# EAGLE design houz_bedroom (EAGLE 9.2.2)
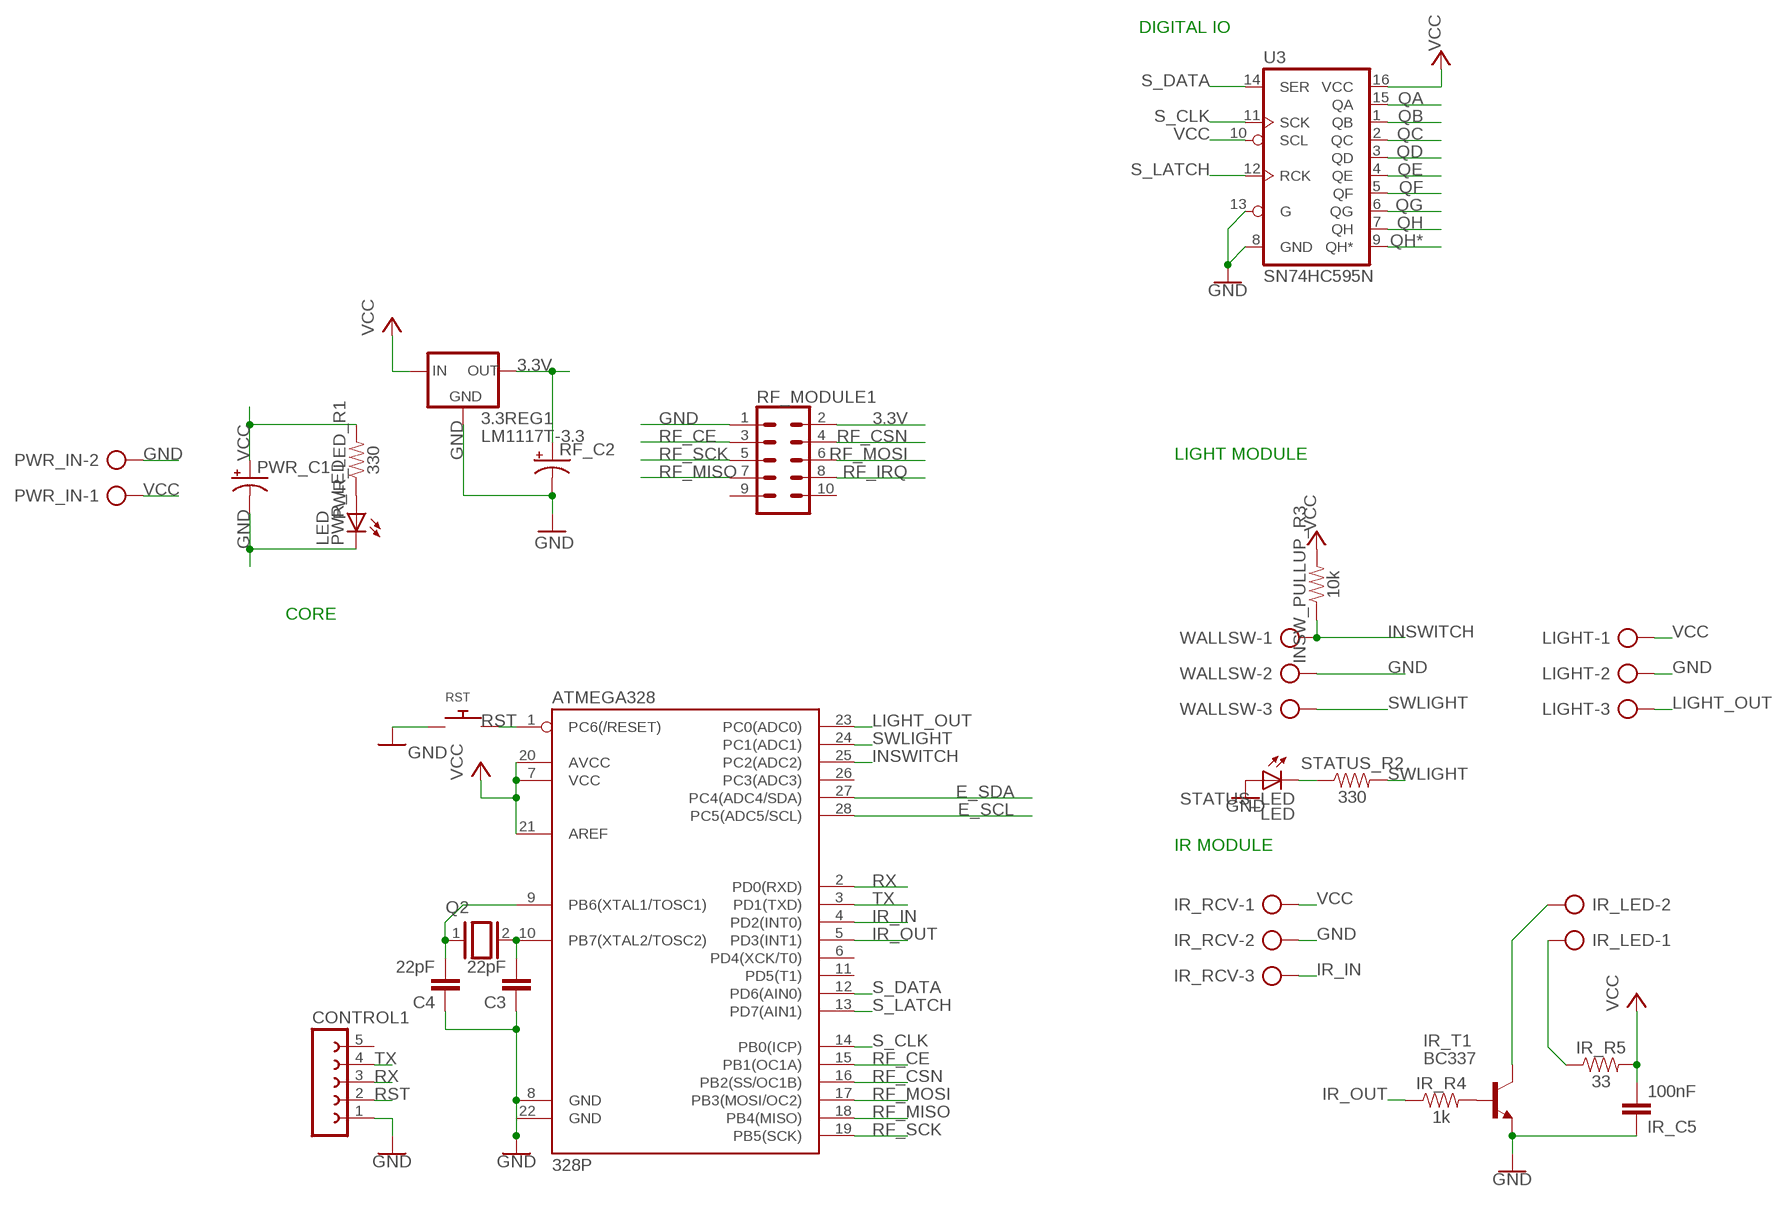
[diagram p0: schematic, sheet 1]

## Parts
3.3REG1  LM1117T-3.3  [TO220]
ATMEGA328  328P  ATMEGA328P_PDIP  [DIP28]
C3  22pF  C-EU050-030X075  [C050-030X075]
C4  22pF  C-EU050-030X075  [C050-030X075]
CONTROL1  FE05-1  [FE05-1]
INSW_PULLUP_R3  10k  RESISTORAXIAL-0.3  [AXIAL-0.3]
IR_C5  100nF  C-EU050-030X075  [C050-030X075]
IR_LED  AK500/2-H  [AK500/2-H]
IR_R4  1k  RESISTORAXIAL-0.3  [AXIAL-0.3]
IR_R5  33  RESISTORAXIAL-0.3  [AXIAL-0.3]
IR_RCV  AK500/3  [AK500/3]
IR_T1  BC337  [TO92]
LIGHT  AK500/3  [AK500/3]
PWR_C1  CPOL-USE7.5-16  [E7,5-16]
PWR_IN  AK500/2-H  [AK500/2-H]
PWR_LED  LED  LED3MM  [LED3MM]
PWR_LED_R1  330  RESISTORAXIAL-0.3  [AXIAL-0.3]
Q2  16MHz  XTAL/S  [QS]
RF_C2  CPOL-USE5-10.5  [E5-10,5]
RF_MODULE1  CONN_05X2NO_SILK  [2X5_NOSILK]
RST  SWITCH_PUSHBUTTONEVQ-PE  [TACT_PANA-EVQ]
STATUS_LED  LED  LED3MM  [LED3MM]
STATUS_R2  330  RESISTORAXIAL-0.3  [AXIAL-0.3]
U3  SN74HC595N  74HC595N  [DIP16]
WALLSW  AK500/3  [AK500/3]

## Nets
3.3V: 3.3REG1.2(OUT) RF_C2.+ RF_MODULE1.2
E_SCL: ATMEGA328.28(PC5(ADC5/SCL))
E_SDA: ATMEGA328.27(PC4(ADC4/SDA))
GND: 3.3REG1.1(GND) ATMEGA328.8(GND) ATMEGA328.22(GND) C3.1 C4.1 CONTROL1.1 IR_C5.1 IR_RCV.2 IR_T1.1(E) LIGHT.2 PWR_C1.- PWR_IN.2 PWR_LED.K(C) RF_C2.- RF_MODULE1.1 RST.P$1 STATUS_LED.A U3.8(GND) U3.13(G) WALLSW.2
INSWITCH: ATMEGA328.25(PC2(ADC2)) INSW_PULLUP_R3.P$1 WALLSW.1
IR_IN: ATMEGA328.4(PD2(INT0)) IR_RCV.3
IR_LED1: IR_LED.1 IR_R5.P$1
IR_LED2: IR_LED.2 IR_T1.3(C)
IR_OUT: ATMEGA328.5(PD3(INT1)) IR_R4.P$1
IR_T1_B: IR_R4.P$2 IR_T1.2(B)
LIGHT_OUT: ATMEGA328.23(PC0(ADC0)) LIGHT.3
N$1: PWR_LED.A PWR_LED_R1.P$1
QA: U3.15(QA)
QB: U3.1(QB)
QC: U3.2(QC)
QD: U3.3(QD)
QE: U3.4(QE)
QF: U3.5(QF)
QG: U3.6(QG)
QH: U3.7(QH)
QH*: U3.9(QH*)
RF_CE: ATMEGA328.15(PB1(OC1A)) RF_MODULE1.3
RF_CSN: ATMEGA328.16(PB2(SS/OC1B)) RF_MODULE1.4
RF_IRQ: RF_MODULE1.8
RF_MISO: ATMEGA328.18(PB4(MISO)) RF_MODULE1.7
RF_MOSI: ATMEGA328.17(PB3(MOSI/OC2)) RF_MODULE1.6
RF_SCK: ATMEGA328.19(PB5(SCK)) RF_MODULE1.5
RST: ATMEGA328.1(PC6(/RESET)) CONTROL1.2 RST.P$2
RX: ATMEGA328.2(PD0(RXD)) CONTROL1.3
S_CLK: ATMEGA328.14(PB0(ICP)) U3.11(SCK)
S_DATA: ATMEGA328.12(PD6(AIN0)) U3.14(SER)
S_LATCH: ATMEGA328.13(PD7(AIN1)) U3.12(RCK)
ST_R2: STATUS_LED.K(C) STATUS_R2.P$1
SWLIGHT: ATMEGA328.24(PC1(ADC1)) STATUS_R2.P$2 WALLSW.3
TX: ATMEGA328.3(PD1(TXD)) CONTROL1.4
VCC: 3.3REG1.3(IN) ATMEGA328.7(VCC) ATMEGA328.20(AVCC) ATMEGA328.21(AREF) INSW_PULLUP_R3.P$2 IR_C5.2 IR_R5.P$2 IR_RCV.1 LIGHT.1 PWR_C1.+ PWR_IN.1 PWR_LED_R1.P$2 U3.10(SCL) U3.16(VCC)
X3: ATMEGA328.9(PB6(XTAL1/TOSC1)) C4.2 Q2.1
X4: ATMEGA328.10(PB7(XTAL2/TOSC2)) C3.2 Q2.2
Unconnected: ATMEGA328.6(PD4(XCK/T0)) ATMEGA328.11(PD5(T1)) ATMEGA328.26(PC3(ADC3)) CONTROL1.5 RF_MODULE1.9 RF_MODULE1.10

## Notes on the sheet
- DIGITAL IO
- LIGHT MODULE
- CORE
- IR MODULE

## Library data of the parts
3.3REG1 = lm1117:LM1117T-*
ATMEGA328 = SparkFun-IC-Microcontroller:ATMEGA328P_PDIP: Atmel 328P Through hole ATMEGA328P uC used in the Arduino 32kb flash, 1k EEPROM, 2k SRAM Datasheet <http://www.sparkfun.com/datasheets/Components/SMD/ATMega328.pdf> SparkFun Products Storefront component: AVR 28 Pin 20MHz 32K 6A/D - ATMega328P <https://www.sparkfun.com/products/9061> (COM-09061) SparkFun Simon Says - Through-Hole Soldering Kit <https://www.sparkfun.com/products/10547> (KIT-10547) SparkFun Learn to Solder - Simon Says <https://www.sparkfun.com/products/13708> (KIT-13708) SparkFun BigTime Watch Kit <https://www.sparkfun.com/products/11734> (KIT-11734) SparkFun ClockIt <https://www.sparkfun.com/products/10930> (KIT-10930) SparkFun Serial Enabled LCD Kit <https://www.sparkfun.com/products/10097> (LCD-10097) SparkFun Simon Tilts - Through Hole Soldering Kit <https://www.sparkfun.com/products/12634> (KIT-12634) SparkFun Frequency Counter Kit <https://www.sparkfun.com/products/10140> (KIT-10140) FabFM Radio Kit <https://www.sparkfun.com/products/11043> (KIT-11043) SparkFun Binary Blaster Kit <https://www.sparkfun.com/products/12037> (KIT-12037) SparkFun Metro-Gnome <https://www.sparkfun.com/products/9236> (KIT-09236) ATmega328 with Arduino Optiboot (Uno) <https://www.sparkfun.com/products/10524> (DEV-10524); PROD_ID: IC-09136
C3 C4 IR_C5 = rcl:C-EU: CAPACITOR, European symbol; SPICEPREFIX: C
CONTROL1 = con-lsta:FE05-1: FEMALE HEADER; OC_FARNELL: unknown; OC_NEWARK: unknown
INSW_PULLUP_R3 IR_R4 IR_R5 PWR_LED_R1 STATUS_R2 = SparkFun-Resistors:RESISTOR: Generic Resistor Package
IR_LED PWR_IN = con-ptr500:AK500/2-H: CONNECTOR Aug. 2004 / PTR Meßtechnik: Die Bezeichnung der Serie AK505 wurde geändert. Es handelt sich hierbei um AK500 in horizontaler Ausführung.; OC_FARNELL: unknown; OC_NEWARK: unknown
IR_RCV LIGHT WALLSW = con-ptr500:AK500/3: CONNECTOR; OC_FARNELL: unknown; OC_NEWARK: unknown
IR_T1 = transistor:BC337: NPN TRANSISTOR
PWR_C1 RF_C2 = adafruit:CPOL-US: POLARIZED CAPACITOR, American symbol
PWR_LED STATUS_LED = adafruit:LED: LED OSRAM: - CHIPLED LG R971, LG N971, LY N971, LG Q971, LY Q971, LO R971, LY R971 LH N974, LH R974 LS Q976, LO Q976, LY Q976 LO Q996 - Hyper CHIPLED LW Q18S LB Q993, LB Q99A, LB R99A - SideLED LS A670, LO A670, LY A670, LG A670, LP A670 LB A673, LV A673, LT A673, LW A673 LH A674 LY A675 LS A676, LA A676, LO A676, LY A676, LW A676 LS A679, LY A679, LG A679 - Hyper Micro SIDELED® LS Y876, LA Y876, LO Y876, LY Y876 LT Y87S - SmartLED LW L88C, LW L88S LB L89C, LB L89S, LG L890 LS L89K, LO L89K, LY L89K LS L896, LA L896, LO L896, LY L896 - TOPLED LS T670, LO T670, LY T670, LG T670, LP T670 LSG T670, LSP T670, LSY T670, LOP T670, LYG T670 LG T671, LOG T671, LSG T671 LB T673, LV T673, LT T673, LW T673 LH T674 LS T676, LA T676, LO T676, LY T676, LB T676, LH T676, LSB T676, LW T676 LB T67C, LV T67C, LT T67C, LS T67K, LO T67K, LY T67K, LW E67C LS E67B, LA E67B, LO E67B, LY E67B, LB E67C, LV E67C, LT E67C LW T67C LS T679, LY T679, LG T679 LS T770, LO T770, LY T770, LG T770, LP T770 LB T773, LV T773, LT T773, LW T773 LH T774 LS E675, LA E675, LY E675, LS T675 LS T776, LA T776, LO T776, LY T776, LB T776 LHGB T686 LT T68C, LB T68C - Hyper Mini TOPLED® LB M676 - Mini TOPLED Santana® LG M470 LS M47K, LO M47K, LY M47K Source: http://www.osram.convergy.de/
Q2 = special:XTAL/S: CRYSTAL
RF_MODULE1 = SparkFun-Connectors:CONN_05X2: Multi connection point. Often used as Generic Header-pin footprint for 0.1 inch spaced/style header connections For AVR SPI programming port, see special device with nice symbol: "AVR_SPI_PROG_5x2.dev" You can populate with any combo of single row headers, but if you'd like an exact match, check these: 2x5 AVR ICSP Male Header <https://www.sparkfun.com/products/778> (PRT-00778) 2x5 Pin Shrouded Header <https://www.sparkfun.com/products/8506> (PRT-08506) On any of the 0.1 inch spaced packages, you can populate with these: Break Away Headers - Straight <https://www.sparkfun.com/products/116> (PRT-00116) Break Away Male Headers - Right Angle <https://www.sparkfun.com/products/553> (PRT-00553) Female Headers <https://www.sparkfun.com/products/115> (PRT-00115) Break Away Headers - Machine Pin <https://www.sparkfun.com/products/117> (PRT-00117) Break Away Female Headers - Swiss Machine Pin <https://www.sparkfun.com/products/743> (PRT-00743) Special note: the shrouded connector mates well with our 5x2 ribbon cables: 2x5 Pin IDC Ribbon Cable <https://www.sparkfun.com/products/8535> (PRT-08535)
RST = adafruit:SWITCH_PUSHBUTTON: Buttons SOFTTOUCHSMD_SJ - Soft touch temporary push button (Super Junk Akihabara) Compatible with SKPMANE010 [Mouser: 688-SKPMAN] C&K_KSS = Digikey: KSS221GLFS
U3 = SparkFun-IC-Logic:74*595: 8-Bit Shift Register (Serial to Parallel) Datasheet <http://cdn.sparkfun.com/datasheets/BreakoutBoards/MM74HC595.pdf> SparkFun Products SparkFun Shift Register Breakout - 74HC595 <https://www.sparkfun.com/products/10680> (BOB-10680); PROD_ID: IC-13123

## Net classes
0 default: clearance 0.205 mm

## Board
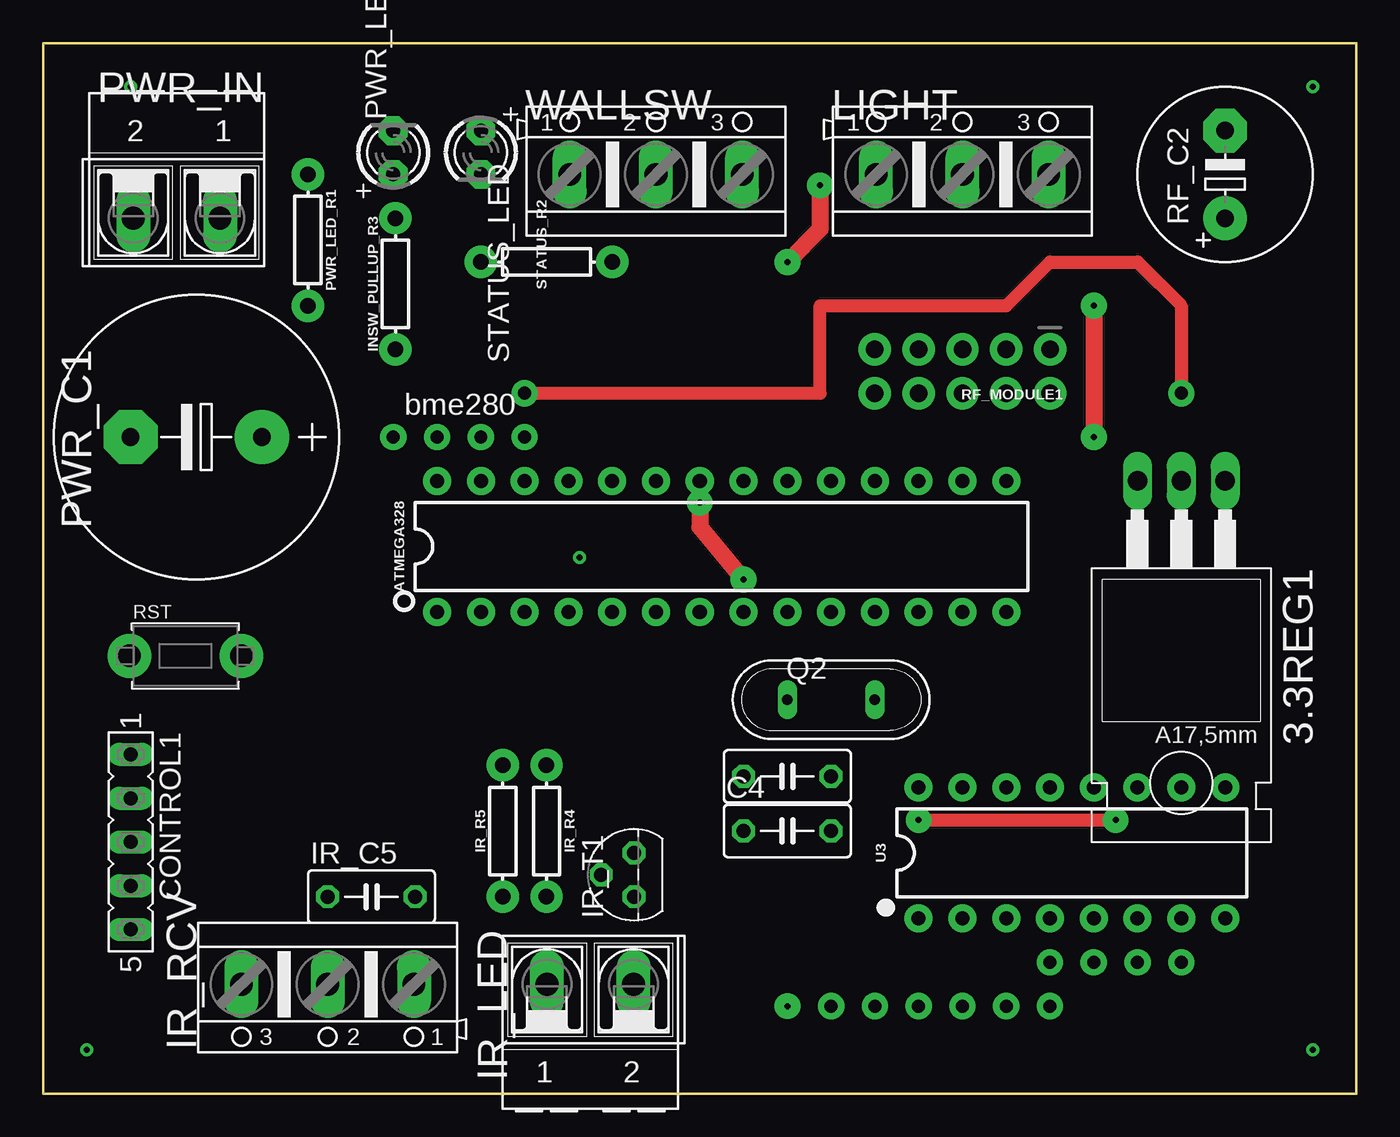
[diagram p1: board, top side]
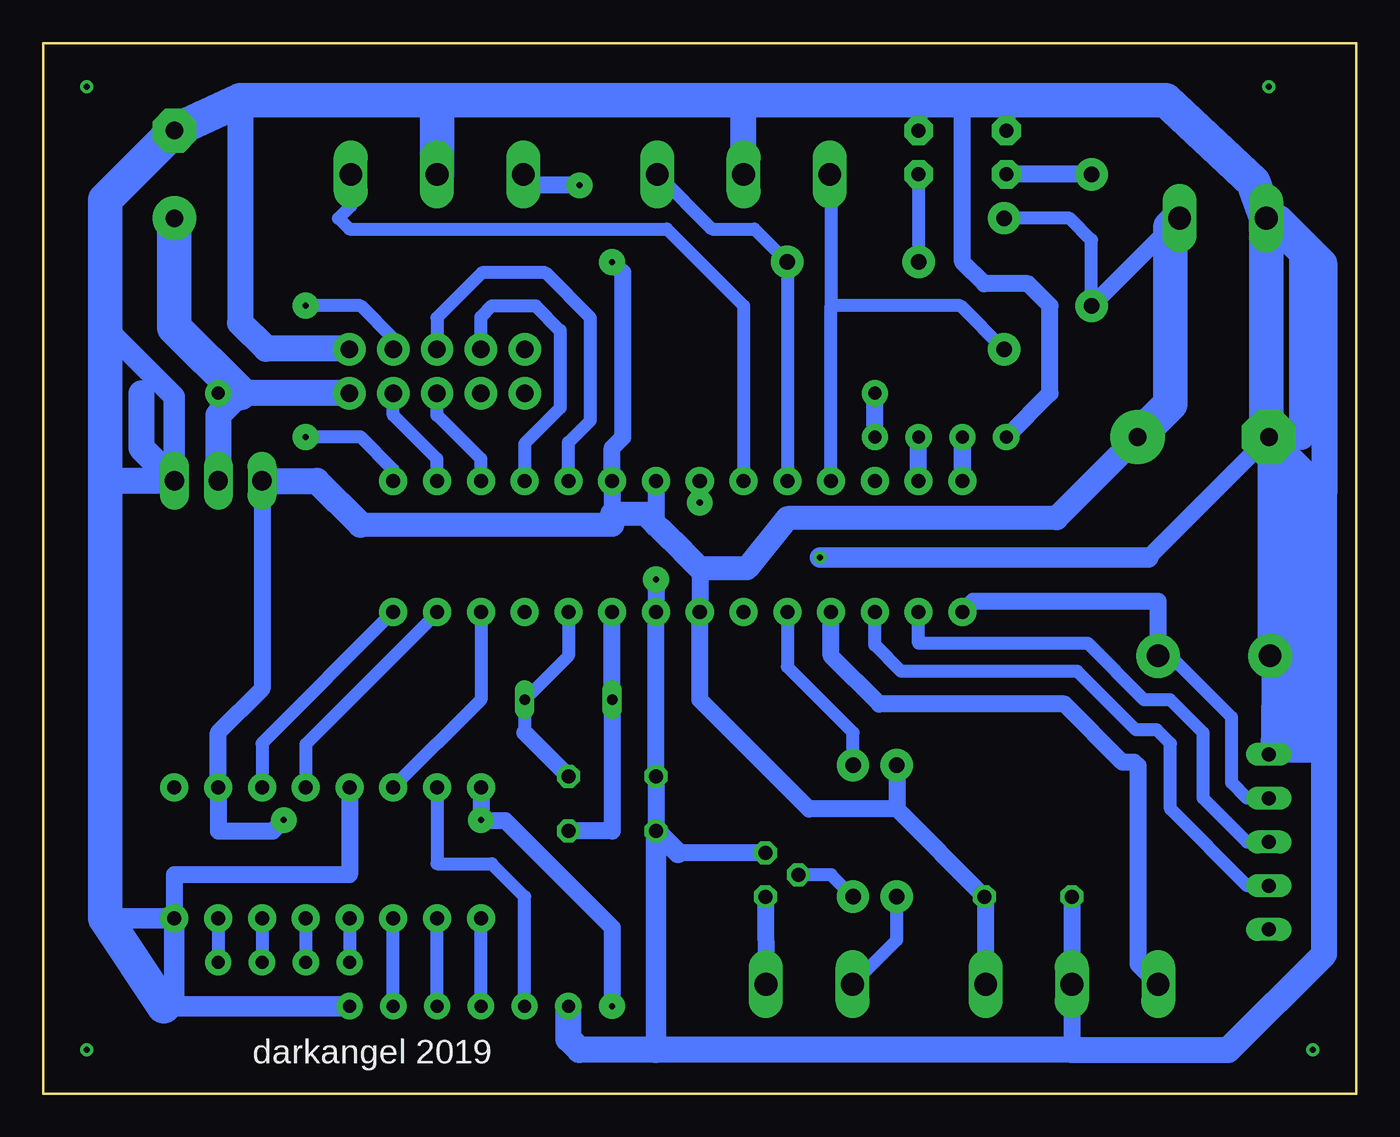
[diagram p2: board, bottom side, seen from below]

Size 76.2 x 60.96 mm. Coordinates in mm from the lower left corner, seen from the top.
Outline: 0,0 0,60.96 76.2,60.96 76.2,0 0,0
Copper layers (1*16): Top 0.035mm / dielectric 1.5mm / Bottom 0.035mm
Design rules "default *": minimum track width 0.75mm, minimum drill 0.35mm, track to track 1mm, track to pad 0.75mm, pad to pad 6mil, via to via 0.75mm, smd to smd 6mil, copper to edge 40mil, drill to drill 6mil, minimum pad ring 10mil, minimum via ring 8mil, stop-mask expansion 4mil, vias tented up to drill 0mil, thermal gap 10mil

### Footprints (pad centres in the part's own frame; a part is rotated, then mirrored left to right if it is on the bottom)
TO220 = drill 1.118 long: 1 -2.54,-6.35; 2 0,-6.35; 3 2.54,-6.35
DIP28 = drill 0.813 pad 1.626: 1 -16.51,-3.81; 2 -13.97,-3.81; 3 -11.43,-3.81; 4 -8.89,-3.81; 5 -6.35,-3.81; 6 -3.81,-3.81; 7 -1.27,-3.81; 8 1.27,-3.81; 9 3.81,-3.81; 10 6.35,-3.81; 11 8.89,-3.81; 12 11.43,-3.81; 13 13.97,-3.81; 14 16.51,-3.81; 15 16.51,3.81; 16 13.97,3.81; 17 11.43,3.81; 18 8.89,3.81; 19 6.35,3.81; 20 3.81,3.81; 21 1.27,3.81; 22 -1.27,3.81; 23 -3.81,3.81; 24 -6.35,3.81; 25 -8.89,3.81; 26 -11.43,3.81; 27 -13.97,3.81; 28 -16.51,3.81
C050-030X075 = drill 0.813 octagon: 1 -2.54,0; 2 2.54,0
FE05-1 = drill 0.813 long: 1 -5.08,0; 2 -2.54,0; 3 0,0; 4 2.54,0; 5 5.08,0
AXIAL-0.3 = drill 0.9 pad 1.88: P$1 -3.81,0; P$2 3.81,0
AK500/2-H = drill 1.321 long: 1 -2.515,0; 2 2.515,0
AK500/3 = drill 1.321 long: 1 -5.004,0; 2 0,0; 3 5.004,0
TO92 = drill 0.813 octagon: 1 1.27,0; 2 0,1.905; 3 -1.27,0
E7,5-16 = drill 1.016 pad 3.15: + -3.81,0 | drill 1.016 pad 3.15 octagon: - 3.81,0
LED3MM = drill 0.813 pad 1.676 octagon: A -1.27,0; K 1.27,0
QS = drill 0.61 long: 1 -2.54,0; 2 2.54,0
E5-10,5 = drill 1.016 pad 2.54: + -2.54,0 | drill 1.016 pad 2.54 octagon: - 2.54,0
2X5_NOSILK = drill 1.016 pad 1.88: 1 0,0; 2 0,2.54; 3 2.54,0; 4 2.54,2.54; 5 5.08,0; 6 5.08,2.54; 7 7.62,0; 8 7.62,2.54; 9 10.16,0; 10 10.16,2.54
TACT_PANA-EVQ = drill 1.3 pad 2.54: P$1 -3.25,0; P$2 3.25,0
DIP16 = drill 0.813 pad 1.626: 1 -8.89,-3.81; 2 -6.35,-3.81; 3 -3.81,-3.81; 4 -1.27,-3.81; 5 1.27,-3.81; 6 3.81,-3.81; 7 6.35,-3.81; 8 8.89,-3.81; 9 8.89,3.81; 10 6.35,3.81; 11 3.81,3.81; 12 1.27,3.81; 13 -1.27,3.81; 14 -3.81,3.81; 15 -6.35,3.81; 16 -8.89,3.81

### Placement (x,y rotation side)
3.3REG1  66.04,29.21 180 top
ATMEGA328  39.37,31.75 0 top
C3  43.18,18.41 0 top
C4  43.18,15.24 0 top
CONTROL1  5.08,14.6 270 top
INSW_PULLUP_R3  20.45,46.99 90 top
IR_C5  19.05,11.43 0 top
IR_LED  31.75,6.35 0 top
IR_R4  29.21,15.24 270 top
IR_R5  26.67,15.24 90 top
IR_RCV  16.51,6.35 180 top
IR_T1  34.29,12.7 90 top
LIGHT  53.34,53.34 0 top
PWR_C1  8.89,38.1 180 top
PWR_IN  7.75,50.8 180 top
PWR_LED  20.32,54.61 90 top
PWR_LED_R1  15.37,49.53 270 top
Q2  45.72,22.86 0 top
RF_C2  68.58,53.34 90 top
RF_MODULE1  58.42,43.18 180 top
RST  8.26,25.4 0 top
STATUS_LED  25.4,54.61 270 top
STATUS_R2  29.21,48.26 0 top
U3  59.69,13.97 0 top
WALLSW  35.56,53.34 0 top

### Tracks (layer width: path | path; a pad name or v marks a point on that pad's centre or on a via)
3.3V  (via drill 0.75 pad 1.52)
  Top 0.75: v27.94,40.64 45.09,40.64 45.09,45.72 55.88,45.72 58.42,48.26 63.5,48.26 66.04,45.72 v66.04,40.64
  Bottom 1: v27.94,38.1 v27.94,40.64 | v66.04,40.64 66.04,39.37
  Bottom 1.5: RF_MODULE1.2 64.77,40.64 66.04,39.37 3.3REG1.2
  Bottom 2: RF_C2.+ 68.58,44.45 64.77,40.64
E_SCL  (via drill 0.75 pad 1.52)
  Bottom 1: 22.86,36.83 v22.86,38.1 ATMEGA328.28 | 22.86,36.83 22.86,35.6 22.86,36.83
E_SDA  (via drill 0.75 pad 1.52)
  Bottom 1: ATMEGA328.27 v25.4,38.1
GND  (via drill 0.35, 0.35 pad 1.5, 0.75 pad 1.52)
  Top 1: v40.64,29.84 38.1,32.89 v38.1,34.29
  Bottom 1: PWR_LED.K 20.19,57.66 | STATUS_LED.A 25.27,57.66 | U3.13 58.42,12.7 68.58,12.7 U3.8 | C4.1 C3.1 ATMEGA328.8 v40.64,29.84 | IR_C5.1 IR_RCV.2 16.51,2.54 | 1.87,19.69 CONTROL1.1 RST.P$1 | PWR_C1.- 12.06,31.12 | v38.1,34.29 ATMEGA328.22 | 22.86,57.66 22.86,48.26 21.59,46.99 19.05,46.99 17.78,45.72 17.78,40.64 v20.32,38.1 | IR_T1.1 39.37,13.97
  Bottom 1.2: 72.58,10.16 U3.8 68.58,5.08 | 12.06,31.12 v31.11,31.12 | 39.37,13.97 C4.1 40.64,2.54 | v58.42,5.08 68.58,5.08 | 68.58,5.08 69.22,5.08
  Bottom 1.25: 3.3REG1.1 68.58,40.45 72.58,44.45
  Bottom 1.5: RF_MODULE1.1 58.46,43.22 63.27,43.22 64.77,44.72 64.77,57.66 | RST.P$1 5,38.02 PWR_C1.- 3.17,36.2 3.17,20.32 3.81,20.32 4.45,20.95 4.45,35.56 3.53,36.47 | 72.58,35.56 3.3REG1.1 70.48,37.47 70.48,40.64 | WALLSW.2 35.56,57.66 | v45.72,5.08 45.72,3.18 45.09,2.54 40.64,2.54 16.51,2.54 7.43,2.54 1.87,8.1 1.87,19.69 1.87,34.82 | 1.87,34.82 3.53,36.47 | 3.53,36.47 5.23,38.17 | 1.87,34.82 1.87,48.23 4.45,50.8 PWR_IN.2 3.17,48.74 3.17,38.1
  Bottom 2: PWR_C1.- 5.23,38.17 PWR_IN.2 5.97,52.88 11.05,57.66 20.19,57.66 22.86,57.66 25.27,57.66 35.56,57.66 53.34,57.66 | 53.34,57.66 64.77,57.66 RF_C2.- 72.58,51.88 72.58,44.45 72.58,35.56 72.58,10.16 69.22,5.08 | LIGHT.2 53.34,57.66
INSWITCH
  Bottom 0.75: WALLSW.1 30.48,53.26 30.48,45.72 | INSW_PULLUP_R3.P$1 22.99,45.72 30.48,45.72 | ATMEGA328.25 30.48,45.72
IR_IN
  Bottom 1: IR_RCV.3 12.67,7.51 12.67,19.02 12.88,19.23 13.57,19.23 16.94,22.61 27.69,22.61 30.48,25.4 ATMEGA328.4
IR_LED1
  Bottom 0.75: IR_LED.1 26.67,8.91 IR_R5.P$1
IR_LED2
  Bottom 1: IR_T1.3 IR_LED.2
IR_OUT
  Bottom 0.75: ATMEGA328.5 33.02,24.77 29.21,20.95 IR_R4.P$1
IR_T1_B
  Bottom 0.75: IR_R4.P$2 30.48,12.7 IR_T1.2
LIGHT_OUT
  Bottom 0.75: ATMEGA328.23 35.56,45.72 40.01,50.16 58.42,50.16 59.05,50.8 58.34,51.51 LIGHT.3
N$1
  Bottom 1: PWR_LED_R1.P$1 PWR_LED.A
N$3  (via drill 0.35)
  other vias: 73.66,58.42
N$4  (via drill 0.35)
  other vias: 73.66,2.54
N$6  (via drill 0.35)
  other vias: 2.54,2.54
N$7  (via drill 0.35)
  other vias: 5.08,58.42
QA  (via drill 0.75 pad 1.52)
  Bottom 0.75: v48.26,5.08 48.26,11.43 50.16,13.33 53.34,13.33 U3.15
QB  (via drill 0.75 pad 1.52)
  Bottom 0.75: v50.8,5.08 U3.1
QC  (via drill 0.75 pad 1.52)
  Bottom 0.75: v53.34,5.08 U3.2
QD  (via drill 0.75 pad 1.52)
  Bottom 0.75: v55.88,5.08 U3.3
QE  (via drill 0.75 pad 1.52)
  Bottom 0.75: U3.4 v58.42,7.62
QF  (via drill 0.75 pad 1.52)
  Bottom 0.75: U3.5 v60.96,7.62
QG  (via drill 0.75 pad 1.52)
  Bottom 0.75: U3.6 v63.5,7.62
QH  (via drill 0.75 pad 1.52)
  Bottom 0.75: U3.7 v66.04,7.62
RF_CE  (via drill 0.35 pad 1.5)
  Top 1: v60.96,45.72 v60.96,38.1
  Bottom 0.75: RF_MODULE1.3 55.88,43.82 57.78,45.72 v60.96,45.72 | ATMEGA328.15 55.88,36.2 57.78,38.1 v60.96,38.1
RF_CSN
  Bottom 0.75: ATMEGA328.16 53.34,36.83 55.88,39.37 RF_MODULE1.4
RF_MISO
  Bottom 0.75: RF_MODULE1.7 50.8,45.09 50.16,45.72 47.62,45.72 46.2,44.29 46.2,39.79 48.26,37.72 ATMEGA328.18
RF_MOSI
  Bottom 0.75: ATMEGA328.17 50.8,36.83 53.34,39.37 RF_MODULE1.6
RF_SCK
  Bottom 0.75: ATMEGA328.19 45.72,37.79 44.45,39.06 44.45,45.02 47.06,47.63 50.73,47.63 53.34,45.02 RF_MODULE1.5
RST
  Bottom 0.75: CONTROL1.2 6.35,17.15 7.24,18.03 7.24,21.84 10.79,25.4 RST.P$2
  Bottom 1: RST.P$2 11.51,28.58 22.23,28.58 ATMEGA328.1
RX
  Bottom 0.75: CONTROL1.3 6.35,14.6 8.89,17.15 8.89,20.95 10.8,22.86 12.32,22.86 15.59,26.13 25.4,26.13 ATMEGA328.2
S_CLK
  Bottom 0.75: U3.11 63.5,20.32 ATMEGA328.14
S_DATA
  Bottom 0.75: U3.14 50.8,22.86 ATMEGA328.12
S_LATCH
  Bottom 0.75: ATMEGA328.13 53.34,27.89 60.96,20.27 U3.12
ST_R2
  Bottom 0.75: STATUS_LED.K STATUS_R2.P$1
SWLIGHT
  Bottom 0.75: WALLSW.3 37.39,50.16 34.92,50.16 STATUS_R2.P$2 ATMEGA328.24
TX
  Bottom 0.75: CONTROL1.4 6.35,12.06 10.79,16.51 10.79,20.32 11.59,21.11 12.79,21.11 16.19,24.51 26.42,24.51 27.94,26.03 ATMEGA328.3
VCC  (via drill 0.35 pad 1.5)
  Top 0.75: v50.8,15.87 v62.23,15.87
  Top 1: v45.09,52.7 45.09,50.16 v43.18,48.26
  Bottom 0.75: PWR_LED_R1.P$2 15.37,49.53 16.64,50.8 INSW_PULLUP_R3.P$2 | 38.1,27.42 ATMEGA328.7 | v50.8,15.87 50.77,15.85
  Bottom 1: PWR_IN.1 15.34,45.72 PWR_LED_R1.P$2 | v62.23,15.87 62.87,15.24 66.04,15.24 U3.10 66.04,20.95 63.5,23.49 3.3REG1.3 | ATMEGA328.21 40.64,33.02 40.35,32.73 40.34,32.73 | 43.18,33.02 43.18,33.66 ATMEGA328.20 43.18,37.47 42.57,38.08 42.57,47.65 v43.18,48.26 | v45.09,52.7 47.7,52.7 LIGHT.1 | U3.16 v50.8,15.87 | IR_RCV.1 21.51,11.35 IR_C5.2 26.67,16.51 | IR_R5.P$2 26.67,16.51 | 50.77,15.85 49.39,15.85 43.18,9.64 v43.18,5.08 | 26.67,16.51 31.75,16.51 38.1,22.86 ATMEGA328.7 38.09,30.48 | 39.02,31.41 39.02,31.42
  Bottom 1.4: 57.78,33.02 43.18,33.02 | 43.18,33.66 41.27,33.66 40.64,33.02 | PWR_C1.+ 17.4,33.4 33.02,33.4 35.37,30.48 38.09,30.48 39.02,31.41 | 39.02,31.42 40.34,32.73
  Bottom 1.5: 3.3REG1.3 60.33,35.56 57.78,33.02
  Bottom 2: PWR_IN.1 10.79,50.27 10.79,40.01 PWR_C1.+
X3
  Bottom 1: ATMEGA328.9 Q2.1 43.18,15.24 C4.2
X4
  Bottom 0.75: ATMEGA328.10 45.72,25.4 Q2.2 48.26,20.95
  Bottom 1: 48.26,20.95 C3.2

### Text on the board
tNames: bme280
bNames: darkangel 2019